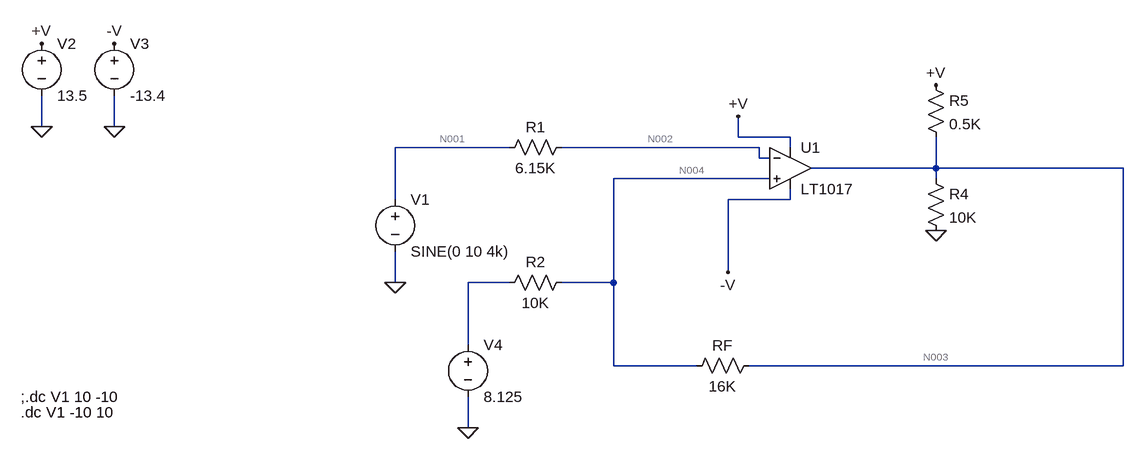
[diagram p0: schematic Actividad1-2(vst=5v).asc]
Actividad1-2(vst=5v).asc, the LTspice schematic file:
Version 4
SHEET 1 880 680
WIRE -832 112 -832 64
WIRE -720 112 -720 64
WIRE 240 128 240 96
WIRE 320 128 240 128
WIRE -112 144 -288 144
WIRE 272 144 -32 144
WIRE 320 144 320 128
WIRE 272 160 272 144
WIRE 288 160 272 160
WIRE 544 176 544 128
WIRE 544 176 352 176
WIRE 832 176 544 176
WIRE 288 192 48 192
WIRE 544 192 544 176
WIRE -288 224 -288 144
WIRE 320 224 320 208
WIRE 320 224 224 224
WIRE 224 336 224 224
WIRE -288 352 -288 304
WIRE -112 352 -176 352
WIRE 48 352 48 192
WIRE 48 352 -32 352
WIRE -176 448 -176 352
WIRE 48 480 48 352
WIRE 176 480 48 480
WIRE 832 480 832 176
WIRE 832 480 256 480
WIRE -176 576 -176 528
FLAG -288 352 0
FLAG -832 112 0
FLAG -720 112 0
FLAG -832 -16 +V
FLAG 240 96 +V
FLAG -720 -16 -V
FLAG 224 336 -V
FLAG 544 272 0
FLAG 544 48 +V
FLAG -176 576 0
SYMBOL res -16 128 R90
WINDOW 0 0 56 VBottom 2
WINDOW 3 32 56 VTop 2
SYMATTR InstName R1
SYMATTR Value 6.15K
SYMBOL res -16 336 R90
WINDOW 0 0 56 VBottom 2
WINDOW 3 32 56 VTop 2
SYMATTR InstName R2
SYMATTR Value 10K
SYMBOL res 272 464 R90
WINDOW 0 0 56 VBottom 2
WINDOW 3 32 56 VTop 2
SYMATTR InstName RF
SYMATTR Value 16K
SYMBOL voltage -288 208 R0
WINDOW 123 0 0 Left 2
WINDOW 39 0 0 Left 2
SYMATTR InstName V1
SYMATTR Value SINE(0 10 4k)
SYMBOL voltage -832 -32 R0
WINDOW 123 0 0 Left 2
WINDOW 39 0 0 Left 2
SYMATTR InstName V2
SYMATTR Value 13.5
SYMBOL voltage -720 -32 R0
WINDOW 123 0 0 Left 2
WINDOW 39 0 0 Left 2
SYMATTR InstName V3
SYMATTR Value -13.4
SYMBOL res 528 176 R0
SYMATTR InstName R4
SYMATTR Value 10K
SYMBOL res 528 32 R0
SYMATTR InstName R5
SYMATTR Value 0.5K
SYMBOL LT1017 320 176 R0
SYMATTR InstName U1
SYMBOL voltage -176 432 R0
WINDOW 123 0 0 Left 2
WINDOW 39 0 0 Left 2
SYMATTR InstName V4
SYMATTR Value 8.125
TEXT -864 528 Left 2 !;.dc V1 10 -10
TEXT -864 552 Left 2 !.dc V1 -10 10

The netlist it stands for:
* Actividad1-2(vst=5v).asc
R1 N002 N001 6.15K
R2 N004 N005 10K
RF N003 N004 16K
V1 N001 0 SINE(0 10 4k)
V2 +V 0 13.5
V3 -V 0 -13.4
R4 N003 0 10K
R5 +V N003 0.5K
XU1 N004 N002 +V -V N003 LT1017  ; pins In+ In- V+ V- OUT
V4 N005 0 8.125
;.dc V1 10 -10
.dc V1 -10 10
.backanno
.end

* Results of the author's LTspice run, read from the files saved beside the schematic
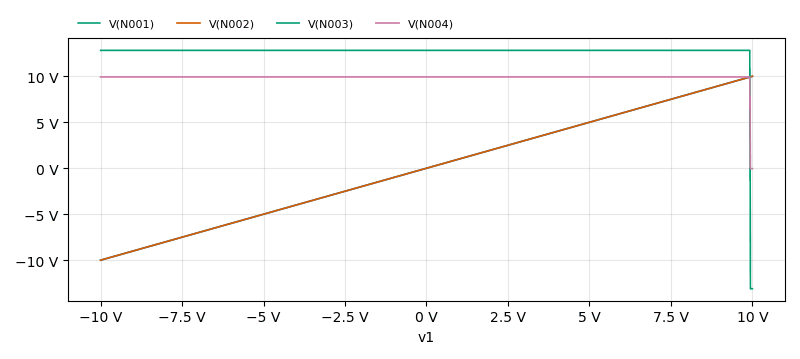
[diagram p1: DC transfer characteristic of Actividad1-2(vst=5v).asc, plotted from the saved traces]
* DC transfer characteristic, 1 run:
*   V(N001): -10 V at v1=-10 V, 10 V at v1=10 V, min -10 V, max 10 V
*   V(N002): -10 V at v1=-10 V, 10 V at v1=10 V, min -10 V, max 10 V
*   V(N003): 12.82 V at v1=-10 V, -13.11 V at v1=10 V, min -13.11 V, max 12.82 V
*   V(N004): 9.931 V at v1=-10 V, -43.14 mV at v1=10 V, min -43.15 mV, max 9.931 V